# Altium project 200318 Universal Pi CAN Interface.PrjPcb
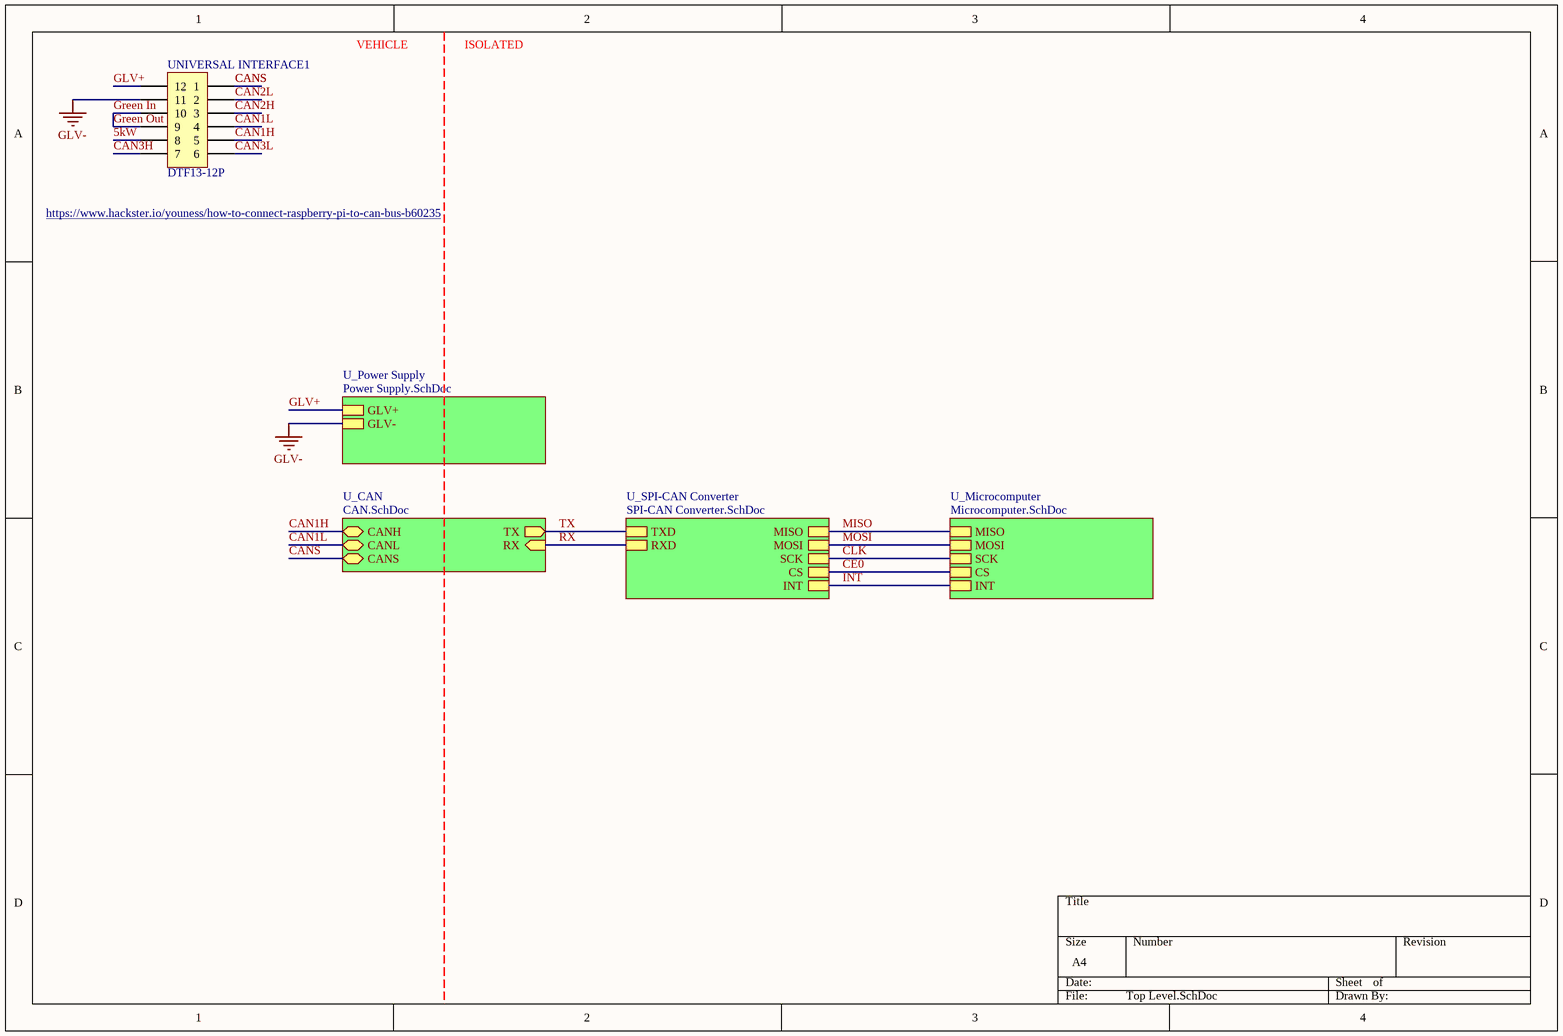
[diagram p0: Top Level.SchDoc]
5 sheets, 58 parts. Net scope: hierarchical (ports join the sheet entries above them; power ports are global).
Board file: PCB.PcbDoc
Sheets:
  Top Level.SchDoc
    U_Power Supply = Power Supply.SchDoc
    U_CAN = CAN.SchDoc
    U_SPI-CAN Converter = SPI-CAN Converter.SchDoc
    U_Microcomputer = Microcomputer.SchDoc

## Sheet Top Level.SchDoc
size A4

### Parts
UNIVERSAL_INTERFACE1  DTF13-12P  [DTF13-12P]

### Sub-sheets
U_CAN = CAN.SchDoc: CANS (bidir), RX (in), CANL (bidir), CANH (bidir), TX (out)
U_Microcomputer = Microcomputer.SchDoc: MISO, MOSI, SCK, CS, INT
U_Power Supply = Power Supply.SchDoc: GLV+, GLV-
U_SPI-CAN Converter = SPI-CAN Converter.SchDoc: TXD, RXD, MISO, MOSI, SCK, CS, INT

### Nets
GLV-: UNIVERSAL_INTERFACE1.11 ; sheet U_Power Supply/GLV-
5kW: UNIVERSAL_INTERFACE1.8
CAN1H: UNIVERSAL_INTERFACE1.5 ; sheet U_CAN/CANH
CAN1L: UNIVERSAL_INTERFACE1.4 ; sheet U_CAN/CANL
CAN2H: UNIVERSAL_INTERFACE1.3
CAN2L: UNIVERSAL_INTERFACE1.2
CAN3H: UNIVERSAL_INTERFACE1.7
CAN3L: UNIVERSAL_INTERFACE1.6
CANS: UNIVERSAL_INTERFACE1.1 ; sheet U_CAN/CANS
CE0: sheet U_SPI-CAN Converter/CS, sheet U_Microcomputer/CS
CLK: sheet U_SPI-CAN Converter/SCK, sheet U_Microcomputer/SCK
GLV+: UNIVERSAL_INTERFACE1.12 ; sheet U_Power Supply/GLV+
Green In: UNIVERSAL_INTERFACE1.9 UNIVERSAL_INTERFACE1.10  [also labelled Green Out]
INT: sheet U_SPI-CAN Converter/INT, sheet U_Microcomputer/INT
MISO: sheet U_SPI-CAN Converter/MISO, sheet U_Microcomputer/MISO
MOSI: sheet U_SPI-CAN Converter/MOSI, sheet U_Microcomputer/MOSI
RX: sheet U_CAN/RX, sheet U_SPI-CAN Converter/RXD
TX: sheet U_CAN/TX, sheet U_SPI-CAN Converter/TXD

### Notes on the sheet
- VEHICLE
- ISOLATED
- https://www.hackster.io/youness/how-to-connect-raspberry-pi-to-can-bus-b60235

### Library data of the parts
UNIVERSAL_INTERFACE1 = DTF13-12P[[/\]]DTF13-12P: Positions: 12; Pitch: 4.45mm; Angle: 90; Flange: Yes; Contact: Nickel; Part Number: DTF13-12P; Row Spacing: 4.45mm; Digikey Part Number: 1734-1861-ND; Digikey Link: https://www.digikey.com/product-detail/en/te-connectivity-deutsch-connectors/DTF13-12PA/1734-1861-ND/9744662

## Sheet Power Supply.SchDoc
size A4
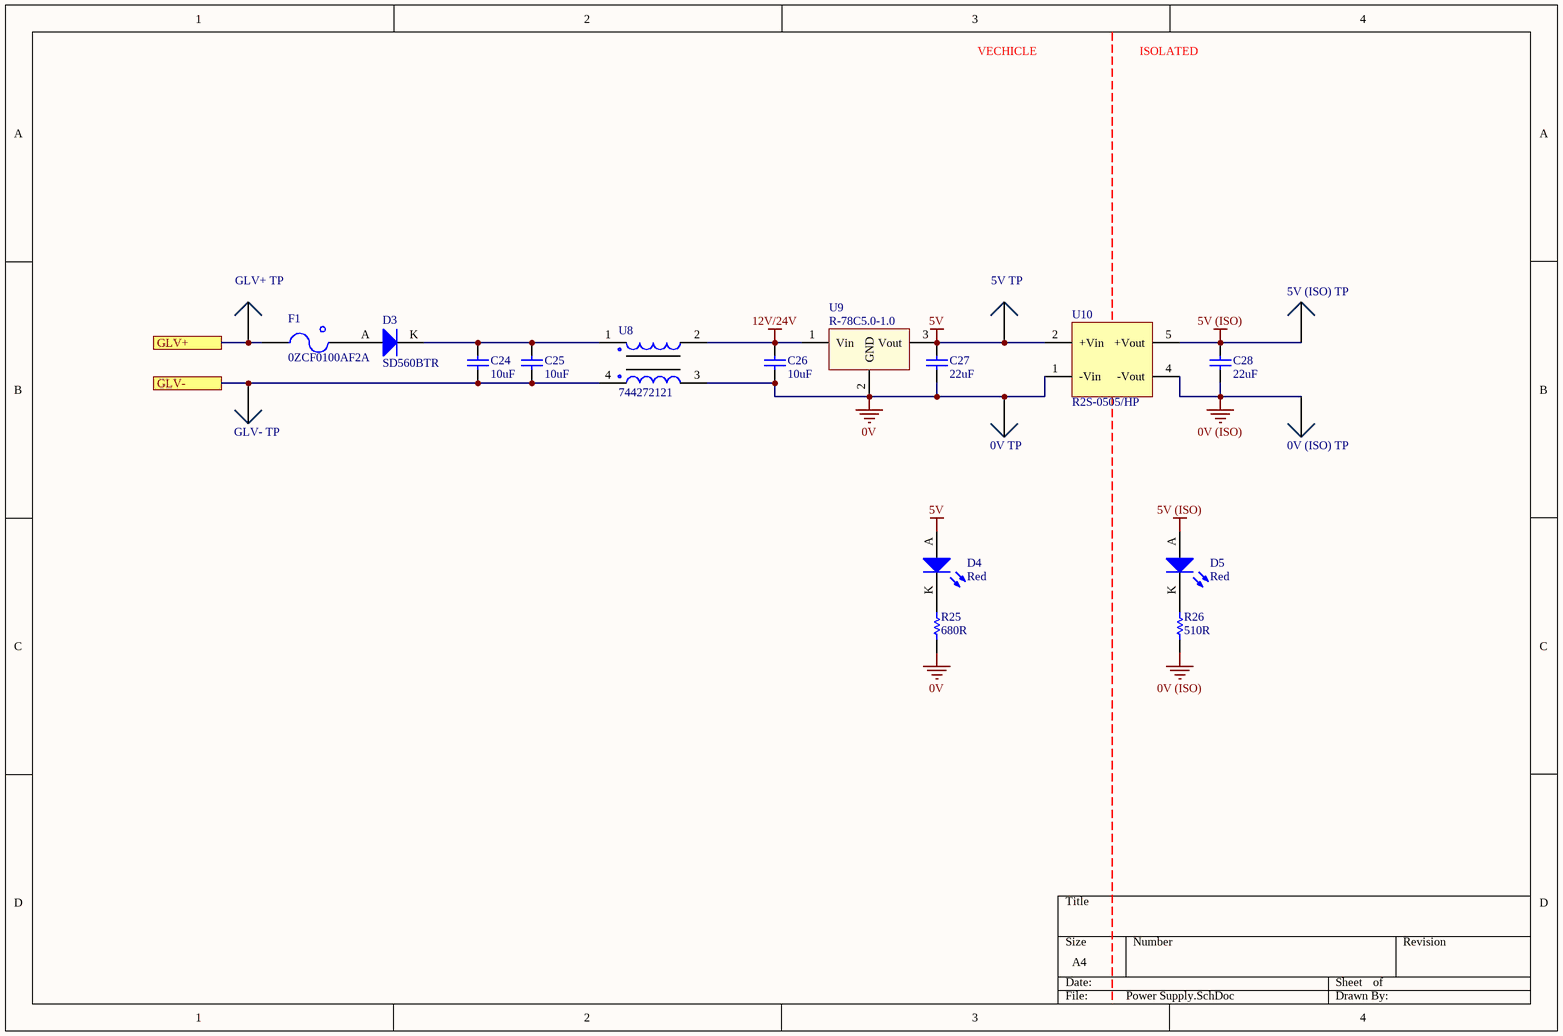
[diagram p1: Power Supply.SchDoc]

### Parts
0V_(ISO)_TP  0mm  [SMD Test Point]  (value not drawn)
0V_TP  0mm  [SMD Test Point]  (value not drawn)
5V_(ISO)_TP  0mm  [SMD Test Point]  (value not drawn)
5V_TP  0mm  [SMD Test Point]  (value not drawn)
C24  10uF  [0805]
C25  10uF  [0805]
C26  10uF  [0805]
C27  22uF  [1206]
C28  22uF  [1206]
D3  SD560BTR  [SMB Diode]
D4  Red  [0805 LED]
D5  Red  [0805 LED]
F1  0ZCF0100AF2A  [2920]
GLV+_TP  0mm  [SMD Test Point]  (value not drawn)
GLV-_TP  0mm  [SMD Test Point]  (value not drawn)
R25  680R  [0805]
R26  510R  [0805]
U8  744272121  [Wurth 4-PC Pad]
U9  R-78C5.0-1.0  [RECOM 3-SIP]
U10  R2S-0505/HP  [RECOM 8-SMD (5 Pin)]

### Ports
GLV+, GLV-

### Nets
0V: 0V_TP.1 C26.1 C27.1 R25.1 U8.3 U9.2(GND) U10.1(-Vin)
0V (ISO): 0V_(ISO)_TP.1 C28.1 R26.1 U10.4(-Vout)
5V: 5V_TP.1 C27.2 D4.A U9.3(Vout) U10.2(+Vin)
5V (ISO): 5V_(ISO)_TP.1 C28.2 D5.A U10.5(+Vout)
12V/24V: C26.2 U8.2 U9.1(Vin)
GLV-: C24.1 C25.1 GLV-_TP.1 U8.4 ; port GLV-
GLV+: F1.1 GLV+_TP.1 ; port GLV+
NetC24_2: C24.2 C25.2 D3.K U8.1
NetD3_A: D3.A F1.2
NetD4_K: D4.K R25.2
NetD5_K: D5.K R26.2

### Notes on the sheet
- VECHICLE
- ISOLATED

### Library data of the parts
0V_(ISO)_TP 0V_TP 5V_(ISO)_TP 5V_TP GLV+_TP GLV-_TP = SMD Test Point: Positions: 1; Row Spacing: 0; Flange: No; Contact: NA; Part Number: SMD Test Point; Pitch: 0mm; Angle: 0
C24-C26 = GRM21BR6YA106KE43L: Manufacturer: muRata; Tolerance: 10%; Material: X5R; Rated Voltage: 50V; Part Number: GRM21BR6YA106KE43L; Value: 10uF; Digikey Part Number: 490-10514-6-ND
C27 C28 = CC1206MKX5R7BB226: Manufacturer: YAGEO; Tolerance: 20%; Material: Ceramic; Rated Voltage: 16V; Part Number: CC1206MKX5R7BB226; Value: 22uF; Digikey Part Number: 311-1997-2-ND
D3 = SD560BTR: 1.2V_F 600V 5A SMB; Manufacturer: SMC Diode Solutions; Part Number: SD560BTR; Digikey Part Number: 1655-1530-2-ND; Digikey Link: https://www.digikey.com/product-detail/en/smc-diode-solutions/SD560BTR/1655-1530-2-ND/6022620
D4 D5 = SML-210LTT86: Red LED Indication - Discrete 1.75V 0805 (2012 Metric); Manufacturer: ROHM Semiconductor; Part Number: SML-210LTT86; Colour: Red; Digikey Part Number: 511-1286-1-ND; Digikey Link: https://www.digikey.com/product-detail/en/rohm-semiconductor/SML-210LTT86/511-1286-1-ND/637099
F1 = 0ZCF0100AF2A: PTC RESET FUSE 60V 1A 292; Manufacturer: Littelfuse Inc.; Part Number: 0ZCF0100AF2A; Digikey Part Number: 507-2070-1-ND; Digikey Link: https://www.digikey.com/product-detail/en/bel-fuse-inc/0ZCF0100AF2A/507-2070-1-ND/6210547
R25 = RC0805FR07680RL: Manufacturer: YAGEO; Tolerance: 0.01; Rated Voltage: 0.125W; Part Number: RC0805FR07680RL; Value: 680R; Material: FR-07
R26 = RC0805FR07510RL: Manufacturer: YAGEO; Tolerance: 0.01; Rated Voltage: 0.125W; Part Number: RC0805FR07510RL; Value: 510R; Material: FR-07
U8 = 744272121: 120µH @ 100kHz 2 Line Common Mode Choke Surface Mount 460 Ohms @ 30MHz 2.5A DCR 25mOhm; Manufacturer: Wurth Electronics Inc; Inductance: 120uH @ 100kHz; Part Number: 744272121; Impedence: 460 Ohms @ 30MHz; Material: Wirewound; Rated Current: 2.5A; Digikey Part Number: 732-1489-1-ND; Digikey Link: https://www.digikey.com/product-detail/en/w-rth-elektronik/744272121/732-1489-1-ND/1639501
U9 = R-78C5.0-1.0: CONV DC/DC 1A 5V OUT SIP VERT; Manufacturer: Recom; Isolation: Non-Isolated; Part Number: R-78C5.0-1.0; Digikey Part Number: 945-1395-5-ND; Digikey Link: https://www.digikey.com.au/product-detail/en/recom-power/R-78C5.0-1.0/945-1395-5-ND/2652148
U10 = R2S-0505/HP: Isolated Module DC DC Converter 1 Output 3.3V 606mA 4.5V - 5.5V Input; Manufacturer: Recom; Output Voltage: 5V; Output Power: 2W; Efficiency: 0.85; Part Number: R2S-0505/HP; Input Voltage: 4.5V-5.5V; Isolation: Isolated; Digikey Part Number: 945-1764-5-ND; Digikey Link: https://www.digikey.com/product-detail/en/recom-power/R2S-0505-HP/945-1764-5-ND/2302761

## Sheet CAN.SchDoc
size A4
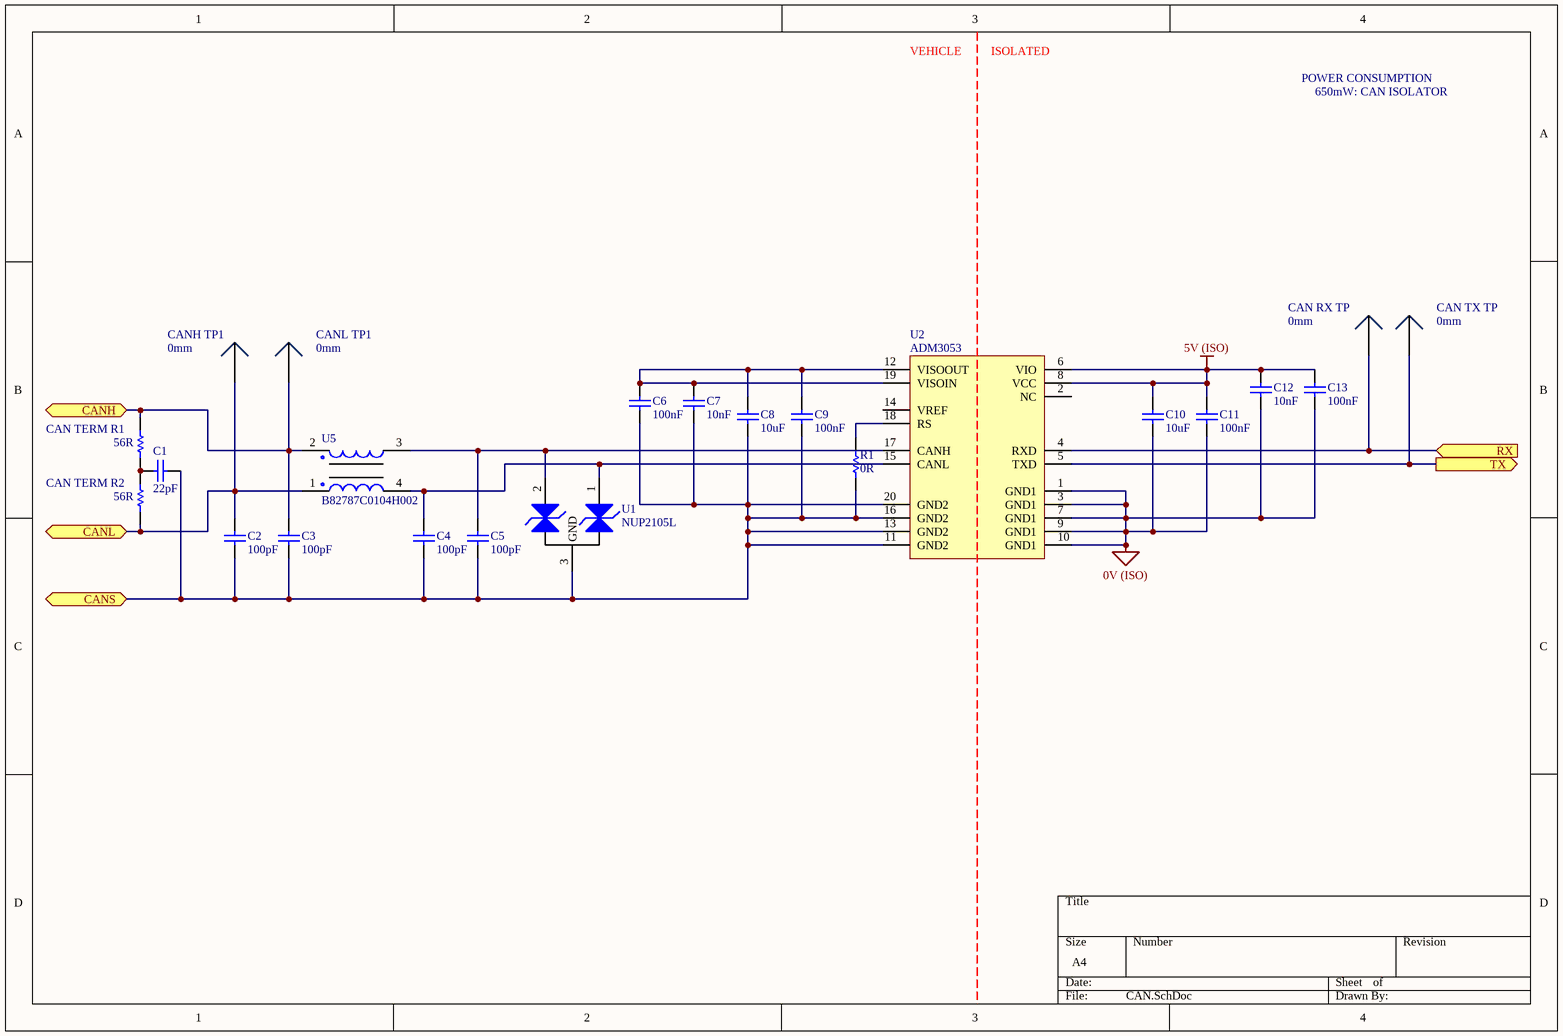
[diagram p2: CAN.SchDoc]

### Parts
C1  22pF  [0805]
C2  100pF  [0805]
C3  100pF  [0805]
C4  100pF  [0805]
C5  100pF  [0805]
C6  100nF  [0805]
C7  10nF  [1206]
C8  10uF  [0805]
C9  100nF  [0805]
C10  10uF  [0805]
C11  100nF  [0805]
C12  10nF  [1206]
C13  100nF  [0805]
CAN_RX_TP  0mm  [SMD Test Point]
CAN_TERM_R1  56R  [0805]
CAN_TERM_R2  56R  [0805]
CAN_TX_TP  0mm  [SMD Test Point]
CANH_TP1  0mm  [SMD Test Point]
CANL_TP1  0mm  [SMD Test Point]
R1  0R  [0805]
U1  NUP2105L  [ON SOT-23]
U2  ADM3053  [AD SOIC-W 20]
U5  B82787C0104H002  [TDK 4-PC Pad]

### Ports
CANH (bidir), CANL (bidir), CANS (bidir), RX (in), TX (out)

### Nets
0V (ISO): C10.1 C11.1 C12.1 C13.1 U2.1(GND1) U2.3(GND1) U2.7(GND1) U2.9(GND1) U2.10(GND1)
5V (ISO): C10.2 C11.2 C12.2 C13.2 U2.6(VIO) U2.8(VCC)
CAN1H: C3.2 CAN_TERM_R1.2 CANL_TP1.1 U5.2 ; port CANH
CAN1L: C2.2 CAN_TERM_R2.1 CANH_TP1.1 U5.1 ; port CANL
CANS: C1.1 C2.1 C3.1 C4.1 C5.1 C6.1 C7.1 C8.1 C9.1 R1.1 U1.3(GND) U2.11(GND2) U2.13(GND2) U2.16(GND2) U2.20(GND2) ; port CANS
RX: CAN_RX_TP.1 U2.4(RXD) ; port RX
TX: CAN_TX_TP.1 U2.5(TXD) ; port TX
NetC1_2: C1.2 CAN_TERM_R1.1 CAN_TERM_R2.2
NetC4_2: C4.2 U1.1(CAN_H) U2.15(CANL) U5.4
NetC5_2: C5.2 U1.2(CAN_L) U2.17(CANH) U5.3
NetC6_2: C6.2 C7.2 C8.2 C9.2 U2.12(VISOOUT) U2.19(VISOIN)
NetR1_2: R1.2 U2.18(RS)

Not connected (* = marked no-connect by the designer): U2 2(NC) 14(VREF)

### Notes on the sheet
- VEHICLE
- ISOLATED
- POWER CONSUMPTION
- 650mW: CAN ISOLATOR

### Library data of the parts
C1 = GCM21B5C1H220JA37L: Manufacturer: muRata; Tolerance: 5%; Material: C0G; Rated Voltage: 50V; Part Number: GCM21B5C1H220JA37L; Value: 22pF
C2-C5 = GCM21B5C1H101JA37L: Manufacturer: muRata; Tolerance: 5%; Material: C0G; Rated Voltage: 50V; Part Number: GCM21B5C1H101JA37L; Value: 100pF
C6 C9 C11 C13 = GCM21BR71E104KA37L: Manufacturer: muRata; Tolerance: 10%; Material: X7R; Rated Voltage: 25V; Part Number: GCM21BR71E104KA37L; Value: 100nF
C7 C12 = GCM3195C2A103JA16D: Manufacturer: muRata; Tolerance: 5%; Material: Ceramic; Rated Voltage: 100V; Part Number: GCM3195C2A103JA16D; Value: 10nF; Digikey Part Number: 490-4978-2-ND
C8 C10 = GRM21BR6YA106KE43L: as C24 on sheet Power Supply; Part Number: GRM21BR6YA106KE43L; Value: 10uF; Digikey Part Number: 490-10514-6-ND
CAN_RX_TP CAN_TX_TP CANH_TP1 CANL_TP1 = SMD Test Point: as 0V_(ISO)_TP on sheet Power Supply; Part Number: SMD Test Point; Pitch: 0mm; Angle: 0
CAN_TERM_R1 CAN_TERM_R2 = RC0805FR0756RL: Manufacturer: YAGEO; Tolerance: 0.01; Rated Voltage: 0.125W; Part Number: RC0805FR0756RL; Value: 56R; Material: FR-07
R1 = RC0805FR070RL: Manufacturer: YAGEO; Tolerance: 0.01; Rated Voltage: 0.125W; Part Number: RC0805FR070RL; Value: 0R; Material: FR-07
U1 = NUP2105L: Dual Line CAN Bus Protector; Manufacturer: ON Semiconductor; Part Number: NUP2105L; Digikey Part Number: NUP2105LT1GOSCT-ND; Digikey Link: https://www.digikey.com/product-detail/en/on-semiconductor/NUP2105LT1G/NUP2105LT1GOSCT-ND/1485001
U2 = ADM3053: Isolated CAN Transceiver; Manufacturer: Analogue Devices; Part Number: ADM3053; Digikey Part Number: ADM3053BRWZ-ND; Digikey Link: https://www.digikey.com/product-detail/en/analog-devices-inc/ADM3053BRWZ/ADM3053BRWZ-ND/2709332
U5 = B82787C0104H002: 100µH @ 100kHz 2 Line Common Mode Choke Surface Mount 5.8 kOhms @ 10MHz 150mA DCR 2Ohm; Manufacturer: EPCOS (TDK); Part Number: B82787C0104H002; Inductance: 100µH @ 100kHz; Impedence: 5.8 kOhms @ 10MHz; Material: Wirewound; Rated Current: 150mA; Digikey Part Number: 495-4598-1-ND; Digikey Link: https://www.digikey.com/product-detail/en/epcos-tdk/B82787C0104H002/495-4598-2-ND/3680998

## Sheet SPI-CAN Converter.SchDoc
size A4
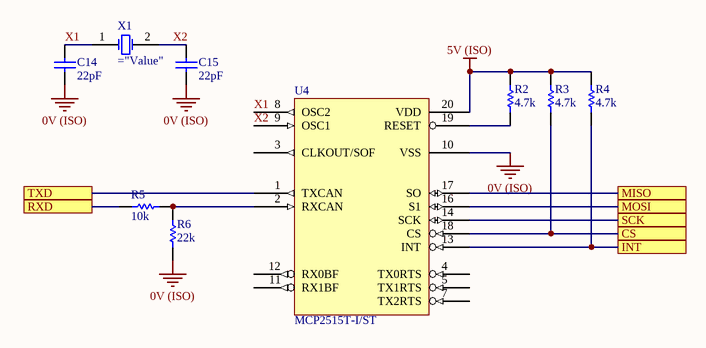
[diagram p3: SPI-CAN Converter.SchDoc]

### Parts
C14  22pF  [0805]
C15  22pF  [0805]
R2  4.7k  [0805]
R3  4.7k  [0805]
R4  4.7k  [0805]
R5  10k  [0805]
R6  22k  [0805]
U4  MCP2515T-I/ST  [MCP 20-TSSOP]
X1  (no value)  [Abracon HC-49/US]

### Ports
CS, INT, MISO, MOSI, RXD, SCK, TXD

### Nets
0V (ISO): C14.1 C15.1 R6.1 U4.10(VSS)
5V (ISO): R2.2 R3.2 R4.2 U4.20(VDD)
CE0: R3.1 U4.18(CS) ; port CS
CLK: U4.14(SCK) ; port SCK
INT: R4.1 U4.13(INT) ; port INT
MISO: U4.17(SO) ; port MISO
MOSI: U4.16(S1) ; port MOSI
RX: R5.1 ; port RXD
TX: U4.1(TXCAN) ; port TXD
X1: C14.2 U4.8(OSC2) X1.1(OSC1)
X2: C15.2 U4.9(OSC1) X1.2(OSC2)
NetR2_1: R2.1 U4.19(RESET)
NetR5_2: R5.2 R6.2 U4.2(RXCAN)

Not connected (* = marked no-connect by the designer): U4 3(CLKOUT/SOF) 4(TX0RTS) 5(TX1RTS) 7(TX2RTS) 11(RX1BF) 12(RX0BF)

### Library data of the parts
C14 C15 = GRM21A5C2E220JW01D: Manufacturer: muRata; Tolerance: ±5%; Material: C0G, NP0; Rated Voltage: 250V; Part Number: GRM21A5C2E220JW01D; Value: 22pF; Digikey Part Number: 490-5534-1-ND
R2-R4 = RC0805FR074K7L: Manufacturer: YAGEO; Tolerance: 0.01; Rated Voltage: 0.125W; Part Number: RC0805FR074K7L; Value: 4.7k; Material: FR-07; Digikey Part Number: 311-4.70KCRCT-ND
R5 = RC0805FR0710KL: Manufacturer: YAGEO; Tolerance: 0.01; Rated Voltage: 0.125W; Part Number: RC0805FR0710KL; Value: 10k; Material: FR-07; Digikey Part Number: 311-10.0KCRCT-ND
R6 = RC0805FR0722KL: Manufacturer: YAGEO; Tolerance: 0.01; Rated Voltage: 0.125W; Part Number: RC0805FR0722KL; Value: 22k; Material: FR-07; Digikey Part Number: 311-22.0KCRCT-ND
U4 = MCP2515T-I/ST: CANbus Controller CAN 2.0 SPI Interface 20-TSSOP; Manufacturer: Microchip Technology; Part Number: MCP2515T-I/ST; Digikey Part Number: MCP2515T-I/STCT-ND; Digikey Link: https://www.digikey.com/product-detail/en/microchip-technology/MCP2515T-I-ST/MCP2515T-I-STCT-ND/4307903
X1 = ABLS-16.000MHZ-B4-T: Manufacturer: Abracon LLC; Load Capacitance: 18pF; ESR: 40R; Part Number: ABLS-16.000MHZ-B4-T; Digikey Part Number: 535-10226-1-ND; Digikey Link: https://www.digikey.com/product-detail/en/abracon-llc/ABLS-16.000MHZ-B4-T/535-10226-1-ND/2184261

## Sheet Microcomputer.SchDoc
size A4
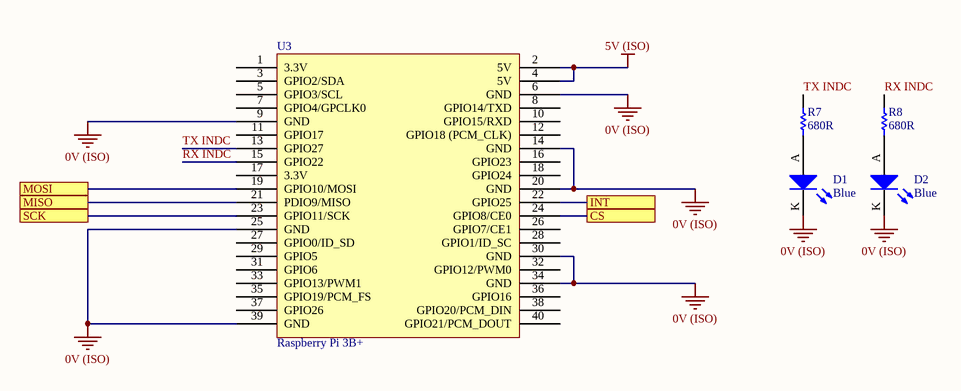
[diagram p4: Microcomputer.SchDoc]

### Parts
D1  Blue  [0805 LED]
D2  Blue  [0805 LED]
R7  680R  [0805]
R8  680R  [0805]
U3  Raspberry Pi 3B+  [Raspberry Pi 3B+]

### Ports
CS, INT, MISO, MOSI, SCK

### Nets
0V (ISO): D1.K D2.K U3.6(GND) U3.9(GND) U3.14(GND) U3.20(GND) U3.25(GND) U3.30(GND) U3.34(GND) U3.39(GND)
5V (ISO): U3.2(5V) U3.4(5V)
CE0: U3.24(GPIO8/CE0) ; port CS
CLK: U3.23(GPIO11/SCK) ; port SCK
INT: U3.22(GPIO25) ; port INT
MISO: U3.21(PDIO9/MISO) ; port MISO
MOSI: U3.19(GPIO10/MOSI) ; port MOSI
RX INDC: R8.2 U3.15(GPIO22)
TX INDC: R7.2 U3.13(GPIO27)
NetD1_A: D1.A R7.1
NetD2_A: D2.A R8.1

Not connected (* = marked no-connect by the designer): U3 1(3.3V) 3(GPIO2/SDA) 5(GPIO3/SCL) 7(GPIO4/GPCLK0) 8(GPIO14/TXD) 10(GPIO15/RXD) 11(GPIO17) 12(GPIO18_(PCM_CLK)) 16(GPIO23) 17(3.3V) 18(GPIO24) 26(GPIO7/CE1) 27(GPIO0/ID_SD) 28(GPIO1/ID_SC) 29(GPIO5) 31(GPIO6) 32(GPIO12/PWM0) 33(GPIO13/PWM1) 35(GPIO19/PCM_FS) 36(GPIO16) 37(GPIO26) 38(GPIO20/PCM_DIN) 40(GPIO21/PCM_DOUT)

### Library data of the parts
D1 D2 = SML-MN2BCTT86C: LED BLUE CLEAR 2012 SMD; Manufacturer: ROHM Semiconductor; Part Number: SML-MN2BCTT86C; Colour: Blue; Digikey Part Number: 846-1207-1-ND; Digikey Link: https://www.digikey.com/product-detail/en/rohm-semiconductor/SMLMN2BCTT86C/846-1207-1-ND/6057239
R7 R8 = RC0805FR07680RL: as R25 on sheet Power Supply; Part Number: RC0805FR07680RL; Value: 680R; Material: FR-07; Digikey Part Number: 311-680CRCT-ND
U3 = Raspberry Pi 3B+: 1.4GHz 64-bit quad-core processor, dual-band wireless LAN, Bluetooth 4.2/BLE, faster Ethernet, and Power-over-Ethernet support (with separate PoE HAT); Part Number: Raspberry Pi 3B+; Link: https://www.raspberrypi.org/products/raspberry-pi-3-model-b-plus/

## Nets that join several sheets
0V (ISO): Power Supply (0V_(ISO)_TP.1 C28.1 R26.1 U10.4), CAN (9 pins), SPI-CAN Converter (C14.1 C15.1 R6.1 U4.10), Microcomputer (10 pins)
5V (ISO): Power Supply (5V_(ISO)_TP.1 C28.2 D5.A U10.5), CAN (6 pins), SPI-CAN Converter (R2.2 R3.2 R4.2 U4.20), Microcomputer (U3.2 U3.4)
GLV-: Top Level (UNIVERSAL_INTERFACE1.11), Power Supply (C24.1 C25.1 GLV-_TP.1 U8.4)
CAN1H: Top Level (UNIVERSAL_INTERFACE1.5), CAN (C3.2 CAN_TERM_R1.2 CANL_TP1.1 U5.2)
CAN1L: Top Level (UNIVERSAL_INTERFACE1.4), CAN (C2.2 CAN_TERM_R2.1 CANH_TP1.1 U5.1)
CANS: Top Level (UNIVERSAL_INTERFACE1.1), CAN (15 pins)
CE0: SPI-CAN Converter (R3.1 U4.18), Microcomputer (U3.24)
CLK: SPI-CAN Converter (U4.14), Microcomputer (U3.23)
GLV+: Top Level (UNIVERSAL_INTERFACE1.12), Power Supply (F1.1 GLV+_TP.1)
INT: SPI-CAN Converter (R4.1 U4.13), Microcomputer (U3.22)
MISO: SPI-CAN Converter (U4.17), Microcomputer (U3.21)
MOSI: SPI-CAN Converter (U4.16), Microcomputer (U3.19)
RX: CAN (CAN_RX_TP.1 U2.4), SPI-CAN Converter (R5.1)
TX: CAN (CAN_TX_TP.1 U2.5), SPI-CAN Converter (U4.1)